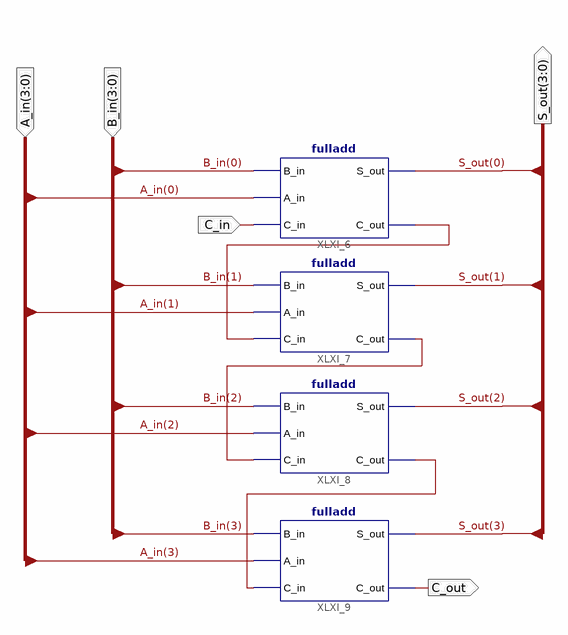
[diagram p0: schematic sheet 1]
// Xilinx ISE schematic fulladd4.sch (spartan6) as structural Verilog: 4 symbols, 5 ports
module fulladd4 (
  input  [3:0] B_in,
  input  [3:0] A_in,
  input  C_in,
  output C_out,
  output [3:0] S_out
);

  wire XLXN_17, XLXN_18, XLXN_19;

  fulladd XLXI_6 (.B_in(B_in[0]), .A_in(A_in[0]), .C_in(C_in), .S_out(S_out[0]), .C_out(XLXN_19));
  fulladd XLXI_7 (.B_in(B_in[1]), .A_in(A_in[1]), .C_in(XLXN_19), .S_out(S_out[1]), .C_out(XLXN_18));
  fulladd XLXI_9 (.B_in(B_in[3]), .A_in(A_in[3]), .C_in(XLXN_17), .S_out(S_out[3]), .C_out(C_out));
  fulladd XLXI_8 (.B_in(B_in[2]), .A_in(A_in[2]), .C_in(XLXN_18), .S_out(S_out[2]), .C_out(XLXN_17));
endmodule
